# EAGLE schematic CMUcam Bridge (EAGLE 6.1)
DATABASE: ./../../../eagle/PARTSDB.TXT
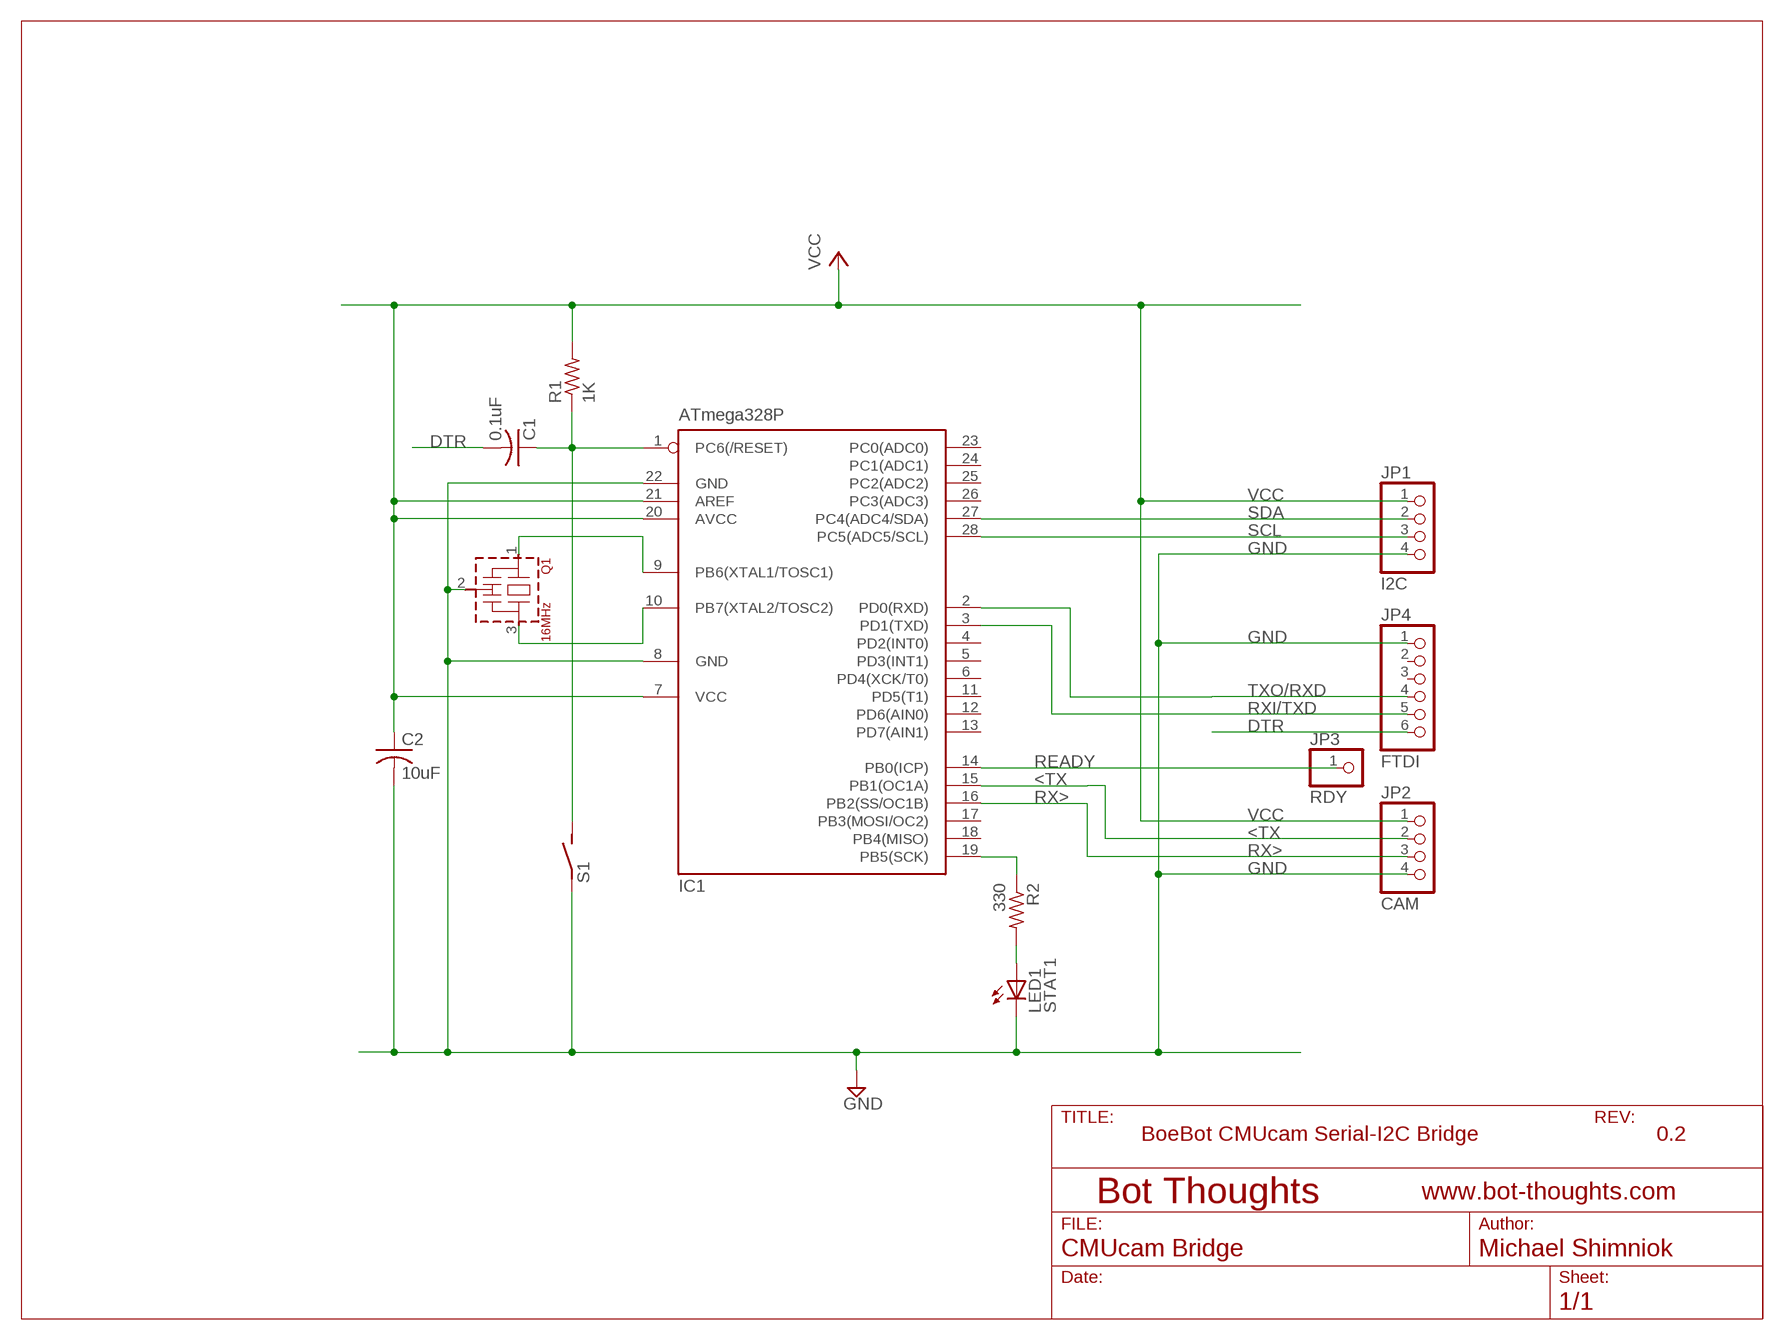
[diagram p0: schematic, sheet 1]

## Parts
C1  0.1uF  C-USC0603  [C0603]
C2  10uF  C-USC0805  [C0805]
IC1  ATmega328P  MEGA8-P  [DIL28-3]
JP1  I2C  PINHD-1X04_2.54-S  [1X04-S]
JP2  CAM  PINHD-1X04_2.54-S  [1X04-S]
JP3  RDY  PINHD-1X01_2.54-S  [1X01-S]
JP4  FTDI  PINHD-1X06_2.54-S  [1X06-S]
LED1  STAT1  LED3MM  [LED3MM]
Q1  16MHz  CSTLS_G*  [CSTLS_G9]
R1  1K  R-US_0204/7  [0204/7]
R2  330  R-US_R0603  [R0603]
S1  RESET\  SPST2EVQ11X09  [EVQ11X09]

## Nets
<TX: IC1.15(PB1(OC1A)) JP2.2
DTR: C1.2 JP4.6
GND: C2.2 IC1.8(GND) IC1.22(GND) JP1.4 JP2.4 JP4.1 LED1.K(C) Q1.2(VSS) S1.1
N$2: IC1.9(PB6(XTAL1/TOSC1)) Q1.1
N$3: IC1.10(PB7(XTAL2/TOSC2)) Q1.3
N$4: LED1.A R2.2
N$5: IC1.19(PB5(SCK)) R2.1
N$6: C1.1 IC1.1(PC6(/RESET)) R1.1 S1.2
READY: IC1.14(PB0(ICP)) JP3.1
RX>: IC1.16(PB2(SS/OC1B)) JP2.3
RXI/TXD: IC1.3(PD1(TXD)) JP4.5
SCL: IC1.28(PC5(ADC5/SCL)) JP1.3
SDA: IC1.27(PC4(ADC4/SDA)) JP1.2
TXO/RXD: IC1.2(PD0(RXD)) JP4.4
VCC: C2.1 IC1.7(VCC) IC1.20(AVCC) IC1.21(AREF) JP1.1 JP2.1 R1.2
Unconnected: IC1.4(PD2(INT0)) IC1.5(PD3(INT1)) IC1.6(PD4(XCK/T0)) IC1.11(PD5(T1)) IC1.12(PD6(AIN0)) IC1.13(PD7(AIN1)) IC1.17(PB3(MOSI/OC2)) IC1.18(PB4(MISO)) IC1.23(PC0(ADC0)) IC1.24(PC1(ADC1)) IC1.25(PC2(ADC2)) IC1.26(PC3(ADC3)) JP4.2 JP4.3

## Notes on the sheet
- BoeBot CMUcam Serial-I2C Bridge | 0.2

## Library data of the parts
C1 = rcl:C-US: CAPACITOR, American symbol; PARTNO: CC0603ZRY5V7BB104
C2 = rcl:C-US: CAPACITOR, American symbol; PARTNO: C1608X5R0J105K
IC1 = atmel:MEGA8-P: MICROCONTROLLER 8 Kbytes FLASH, 1 kbytes SRAM, 512 bytes EEPROM, USART, 4-channel 10 bit ADC, 2-channel 8 bit ADC Pin compatible with Atmega48, ATMega88, ATMega168 Source: avr.lbr; PARTNO: DEV-10524
JP1 JP2 = pinhead-2:PINHD-1X04: PIN HEADER; PARTNO: 2211S-04G
JP3 = pinhead-2:PINHD-1X01: PIN HEADER; BOM: EXCLUDE
JP4 = pinhead-2:PINHD-1X06: PIN HEADER; PARTNO: 2211S-06G
LED1 = led:LED: LED OSRAM: - CHIPLED LG R971, LG N971, LY N971, LG Q971, LY Q971, LO R971, LY R971 LH N974, LH R974 LS Q976, LO Q976, LY Q976 LO Q996 - Hyper CHIPLED LW Q18S LB Q993, LB Q99A, LB R99A - SideLED LS A670, LO A670, LY A670, LG A670, LP A670 LB A673, LV A673, LT A673, LW A673 LH A674 LY A675 LS A676, LA A676, LO A676, LY A676, LW A676 LS A679, LY A679, LG A679 - Hyper Micro SIDELED® LS Y876, LA Y876, LO Y876, LY Y876 LT Y87S - SmartLED LW L88C, LW L88S LB L89C, LB L89S, LG L890 LS L89K, LO L89K, LY L89K LS L896, LA L896, LO L896, LY L896 - TOPLED LS T670, LO T670, LY T670, LG T670, LP T670 LSG T670, LSP T670, LSY T670, LOP T670, LYG T670 LG T671, LOG T671, LSG T671 LB T673, LV T673, LT T673, LW T673 LH T674 LS T676, LA T676, LO T676, LY T676, LB T676, LH T676, LSB T676, LW T676 LB T67C, LV T67C, LT T67C, LS T67K, LO T67K, LY T67K, LW E67C LS E67B, LA E67B, LO E67B, LY E67B, LB E67C, LV E67C, LT E67C LW T67C LS T679, LY T679, LG T679 LS T770, LO T770, LY T770, LG T770, LP T770 LB T773, LV T773, LT T773, LW T773 LH T774 LS E675, LA E675, LY E675, LS T675 LS T776, LA T776, LO T776, LY T776, LB T776 LHGB T686 LT T68C, LB T68C - Hyper Mini TOPLED® LB M676 - Mini TOPLED Santana® LG M470 LS M47K, LO M47K, LY M47K Source: http://www.osram.convergy.de LUXEON: - LUMILED® LXK2-PW12-R00, LXK2-PW12-S00, LXK2-PW14-U00, LXK2-PW14-V00 LXK2-PM12-R00, LXK2-PM12-S00, LXK2-PM14-U00 LXK2-PE12-Q00, LXK2-PE12-R00, LXK2-PE12-S00, LXK2-PE14-T00, LXK2-PE14-U00 LXK2-PB12-K00, LXK2-PB12-L00, LXK2-PB12-M00, LXK2-PB14-N00, LXK2-PB14-P00, LXK2-PB14-Q00 LXK2-PR12-L00, LXK2-PR12-M00, LXK2-PR14-Q00, LXK2-PR14-R00 LXK2-PD12-Q00, LXK2-PD12-R00, LXK2-PD12-S00 LXK2-PH12-R00, LXK2-PH12-S00 LXK2-PL12-P00, LXK2-PL12-Q00, LXK2-PL12-R00 Source: www.luxeon.com KINGBRIGHT: KA-3528ASYC Source: www.kingbright.com; BOM: EXCLUDE
Q1 = murata-resonators:CSTLS_G: Ceramic resonator 2.00 to 10.00 MHz; PARTNO: AWCR-16.00MD
R1 = rcl:R-US_: RESISTOR, American symbol; BOM: EXCLUDE
R2 = rcl:R-US_: RESISTOR, American symbol; PARTNO: CRCW0603330RJNEA
S1 = ads4:SPST2: SPST Switch; PARTNO: SALVAGE